# EAGLE schematic LQFP100 Breakout (EAGLE 6.2)
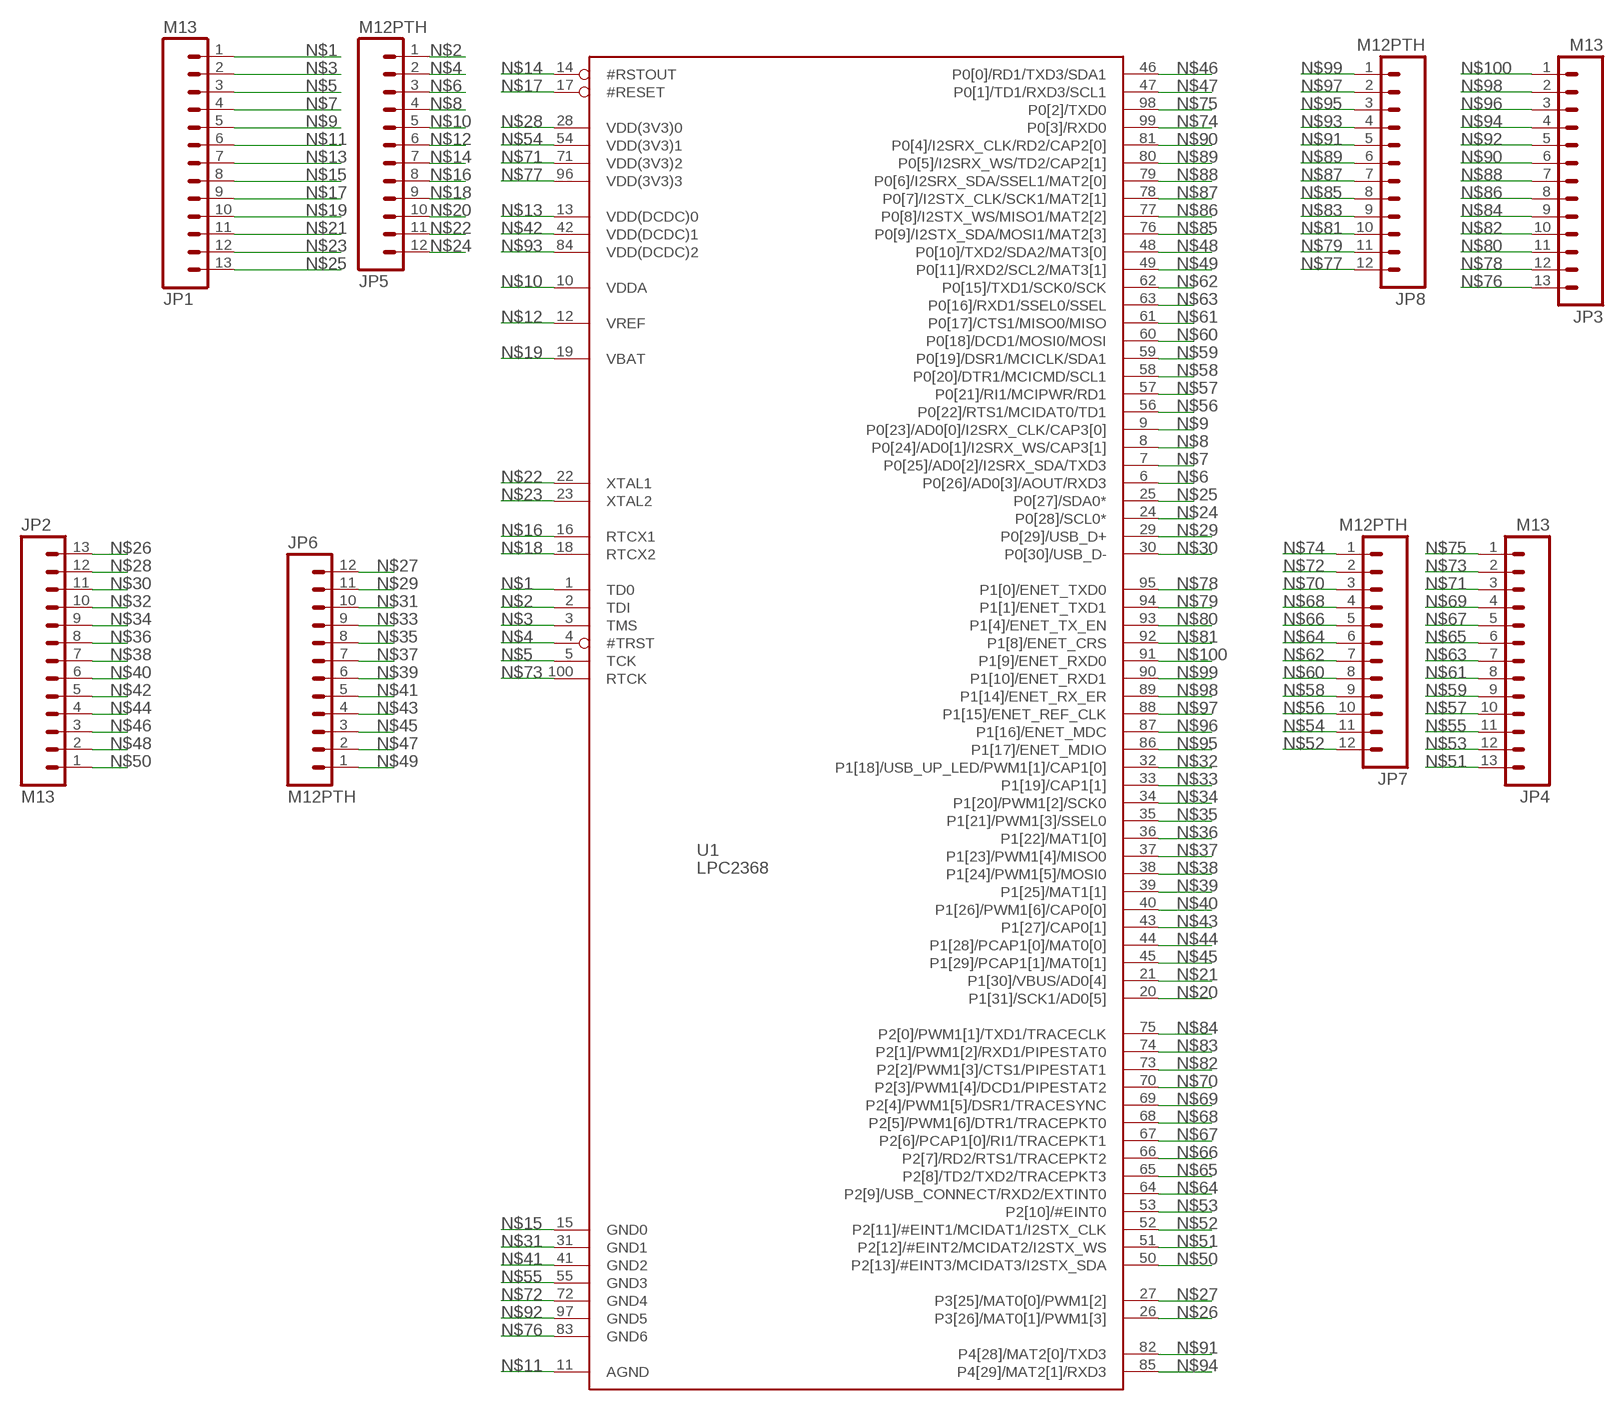
[diagram p0: schematic, sheet 1]

## Parts
JP1  M13  [1X13]
JP2  M13  [1X13]
JP3  M13  [1X13]
JP4  M13  [1X13]
JP5  M12PTH  [1X12]
JP6  M12PTH  [1X12]
JP7  M12PTH  [1X12]
JP8  M12PTH  [1X12]
U1  LPC2368  [LQFP100]

## Nets
N$1: JP1.1 U1.1(TD0)
N$2: JP5.1 U1.2(TDI)
N$3: JP1.2 U1.3(TMS)
N$4: JP5.2 U1.4(#TRST)
N$5: JP1.3 U1.5(TCK)
N$6: JP5.3 U1.6(P0[26]/AD0[3]/AOUT/RXD3)
N$7: JP1.4 U1.7(P0[25]/AD0[2]/I2SRX_SDA/TXD3)
N$8: JP5.4 U1.8(P0[24]/AD0[1]/I2SRX_WS/CAP3[1])
N$9: JP1.5 U1.9(P0[23]/AD0[0]/I2SRX_CLK/CAP3[0])
N$10: JP5.5 U1.10(VDDA)
N$11: JP1.6 U1.11(AGND)
N$12: JP5.6 U1.12(VREF)
N$13: JP1.7 U1.13(VDD(DCDC)0)
N$14: JP5.7 U1.14(#RSTOUT)
N$15: JP1.8 U1.15(GND0)
N$16: JP5.8 U1.16(RTCX1)
N$17: JP1.9 U1.17(#RESET)
N$18: JP5.9 U1.18(RTCX2)
N$19: JP1.10 U1.19(VBAT)
N$20: JP5.10 U1.20(P1[31]/SCK1/AD0[5])
N$21: JP1.11 U1.21(P1[30]/VBUS/AD0[4])
N$22: JP5.11 U1.22(XTAL1)
N$23: JP1.12 U1.23(XTAL2)
N$24: JP5.12 U1.24(P0[28]/SCL0*)
N$25: JP1.13 U1.25(P0[27]/SDA0*)
N$26: JP2.13 U1.26(P3[26]/MAT0[1]/PWM1[3])
N$27: JP6.12 U1.27(P3[25]/MAT0[0]/PWM1[2])
N$28: JP2.12 U1.28(VDD(3V3)0)
N$29: JP6.11 U1.29(P0[29]/USB_D+)
N$30: JP2.11 U1.30(P0[30]/USB_D-)
N$31: JP6.10 U1.31(GND1)
N$32: JP2.10 U1.32(P1[18]/USB_UP_LED/PWM1[1]/CAP1[0])
N$33: JP6.9 U1.33(P1[19]/CAP1[1])
N$34: JP2.9 U1.34(P1[20]/PWM1[2]/SCK0)
N$35: JP6.8 U1.35(P1[21]/PWM1[3]/SSEL0)
N$36: JP2.8 U1.36(P1[22]/MAT1[0])
N$37: JP6.7 U1.37(P1[23]/PWM1[4]/MISO0)
N$38: JP2.7 U1.38(P1[24]/PWM1[5]/MOSI0)
N$39: JP6.6 U1.39(P1[25]/MAT1[1])
N$40: JP2.6 U1.40(P1[26]/PWM1[6]/CAP0[0])
N$41: JP6.5 U1.41(GND2)
N$42: JP2.5 U1.42(VDD(DCDC)1)
N$43: JP6.4 U1.43(P1[27]/CAP0[1])
N$44: JP2.4 U1.44(P1[28]/PCAP1[0]/MAT0[0])
N$45: JP6.3 U1.45(P1[29]/PCAP1[1]/MAT0[1])
N$46: JP2.3 U1.46(P0[0]/RD1/TXD3/SDA1)
N$47: JP6.2 U1.47(P0[1]/TD1/RXD3/SCL1)
N$48: JP2.2 U1.48(P0[10]/TXD2/SDA2/MAT3[0])
N$49: JP6.1 U1.49(P0[11]/RXD2/SCL2/MAT3[1])
N$50: JP2.1 U1.50(P2[13]/#EINT3/MCIDAT3/I2STX_SDA)
N$51: JP4.13 U1.51(P2[12]/#EINT2/MCIDAT2/I2STX_WS)
N$52: JP7.12 U1.52(P2[11]/#EINT1/MCIDAT1/I2STX_CLK)
N$53: JP4.12 U1.53(P2[10]/#EINT0)
N$54: JP7.11 U1.54(VDD(3V3)1)
N$55: JP4.11 U1.55(GND3)
N$56: JP7.10 U1.56(P0[22]/RTS1/MCIDAT0/TD1)
N$57: JP4.10 U1.57(P0[21]/RI1/MCIPWR/RD1)
N$58: JP7.9 U1.58(P0[20]/DTR1/MCICMD/SCL1)
N$59: JP4.9 U1.59(P0[19]/DSR1/MCICLK/SDA1)
N$60: JP7.8 U1.60(P0[18]/DCD1/MOSI0/MOSI)
N$61: JP4.8 U1.61(P0[17]/CTS1/MISO0/MISO)
N$62: JP7.7 U1.62(P0[15]/TXD1/SCK0/SCK)
N$63: JP4.7 U1.63(P0[16]/RXD1/SSEL0/SSEL)
N$64: JP7.6 U1.64(P2[9]/USB_CONNECT/RXD2/EXTINT0)
N$65: JP4.6 U1.65(P2[8]/TD2/TXD2/TRACEPKT3)
N$66: JP7.5 U1.66(P2[7]/RD2/RTS1/TRACEPKT2)
N$67: JP4.5 U1.67(P2[6]/PCAP1[0]/RI1/TRACEPKT1)
N$68: JP7.4 U1.68(P2[5]/PWM1[6]/DTR1/TRACEPKT0)
N$69: JP4.4 U1.69(P2[4]/PWM1[5]/DSR1/TRACESYNC)
N$70: JP7.3 U1.70(P2[3]/PWM1[4]/DCD1/PIPESTAT2)
N$71: JP4.3 U1.71(VDD(3V3)2)
N$72: JP7.2 U1.72(GND4)
N$73: JP4.2 U1.100(RTCK)
N$74: JP7.1 U1.99(P0[3]/RXD0)
N$75: JP4.1 U1.98(P0[2]/TXD0)
N$76: JP3.13 U1.83(GND6)
N$77: JP8.12 U1.96(VDD(3V3)3)
N$78: JP3.12 U1.95(P1[0]/ENET_TXD0)
N$79: JP8.11 U1.94(P1[1]/ENET_TXD1)
N$80: JP3.11 U1.93(P1[4]/ENET_TX_EN)
N$81: JP8.10 U1.92(P1[8]/ENET_CRS)
N$82: JP3.10 U1.73(P2[2]/PWM1[3]/CTS1/PIPESTAT1)
N$83: JP8.9 U1.74(P2[1]/PWM1[2]/RXD1/PIPESTAT0)
N$84: JP3.9 U1.75(P2[0]/PWM1[1]/TXD1/TRACECLK)
N$85: JP8.8 U1.76(P0[9]/I2STX_SDA/MOSI1/MAT2[3])
N$86: JP3.8 U1.77(P0[8]/I2STX_WS/MISO1/MAT2[2])
N$87: JP8.7 U1.78(P0[7]/I2STX_CLK/SCK1/MAT2[1])
N$88: JP3.7 U1.79(P0[6]/I2SRX_SDA/SSEL1/MAT2[0])
N$89: JP8.6 U1.80(P0[5]/I2SRX_WS/TD2/CAP2[1])
N$90: JP3.6 U1.81(P0[4]/I2SRX_CLK/RD2/CAP2[0])
N$91: JP8.5 U1.82(P4[28]/MAT2[0]/TXD3)
N$92: JP3.5 U1.97(GND5)
N$93: JP8.4 U1.84(VDD(DCDC)2)
N$94: JP3.4 U1.85(P4[29]/MAT2[1]/RXD3)
N$95: JP8.3 U1.86(P1[17]/ENET_MDIO)
N$96: JP3.3 U1.87(P1[16]/ENET_MDC)
N$97: JP8.2 U1.88(P1[15]/ENET_REF_CLK)
N$98: JP3.2 U1.89(P1[14]/ENET_RX_ER)
N$99: JP8.1 U1.90(P1[10]/ENET_RXD1)
N$100: JP3.1 U1.91(P1[9]/ENET_RXD0)

## Library data of the parts
JP1-JP4 = SparkFun-Connectors:M13: 13-pin single row .1" header
JP5-JP8 = SparkFun-Connectors:M12: Header 12 Standard 12-pin 0.1" header. Use with straight break away headers (SKU : PRT-00116), right angle break away headers (PRT-00553), swiss pins (PRT-00743), machine pins (PRT-00117), and female headers (PRT-00115).
U1 = KwanSystems:LPC2368